# EAGLE design 2te4x230_In_apli (EAGLE 5.00)
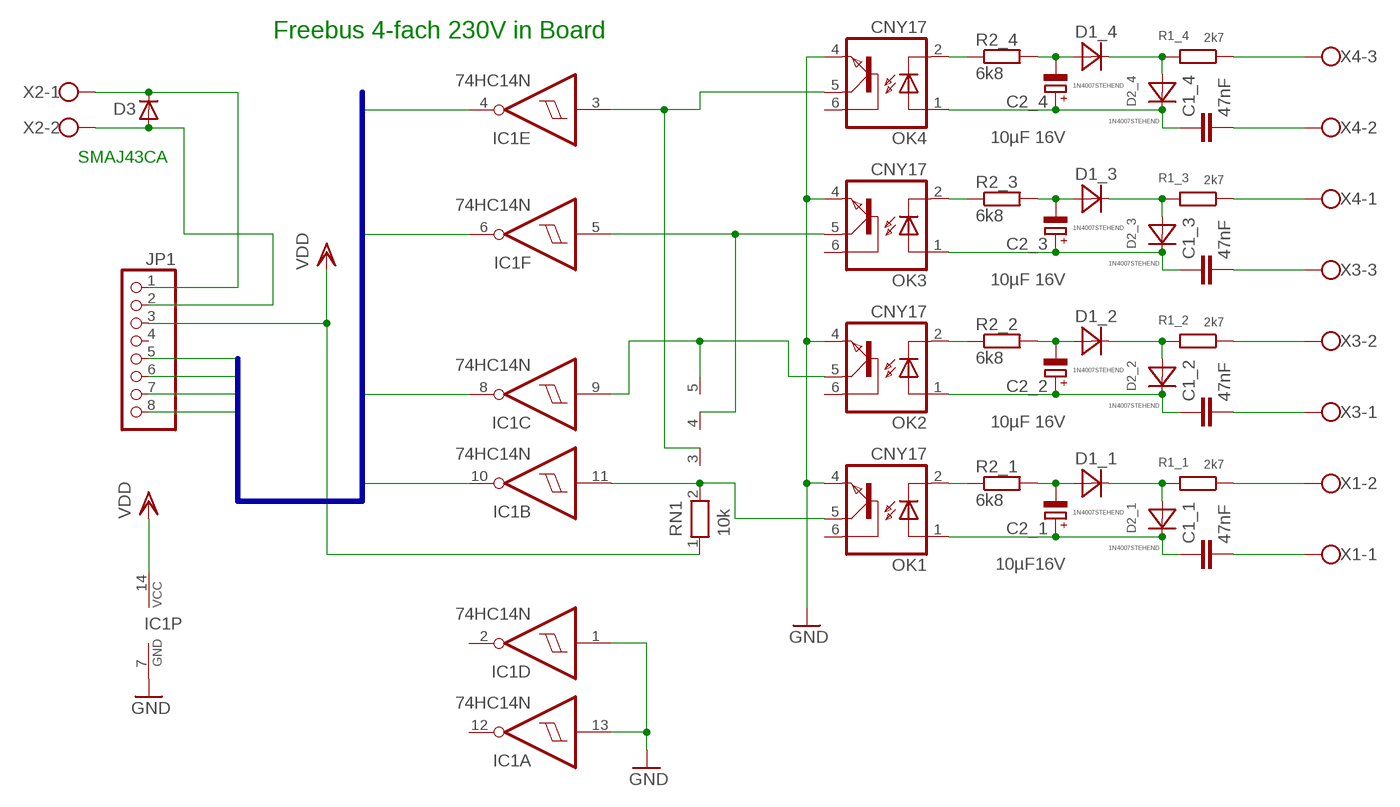
[diagram p0: schematic, sheet 1]

## Parts
C1_1  47nF  C-EU075-063X106  [C075-063X106]
C1_2  47nF  C-EU075-063X106  [C075-063X106]
C1_3  47nF  C-EU075-063X106  [C075-063X106]
C1_4  47nF  C-EU075-063X106  [C075-063X106]
C2_1  10µF16V  CPOL-EUE2-4  [E2-4]
C2_2  10µF 16V  CPOL-EUE2-4  [E2-4]
C2_3  10µF 16V  CPOL-EUE2-4  [E2-4]
C2_4  10µF 16V  CPOL-EUE2-4  [E2-4]
D1_1  1N4007STEHEND  [RAD2,5]
D1_2  1N4007STEHEND  [RAD2,5]
D1_3  1N4007STEHEND  [RAD2,5]
D1_4  1N4007STEHEND  [RAD2,5]
D2_1  1N4007STEHEND  [RAD2,5]
D2_2  1N4007STEHEND  [RAD2,5]
D2_3  1N4007STEHEND  [RAD2,5]
D2_4  1N4007STEHEND  [RAD2,5]
D3  D-  [SMA]
IC1  74HC14N  [DIL14]
JP1  PINHD-1X8  [1X08]
OK1  CNY17  [DIL06]
OK2  CNY17  [DIL06]
OK3  CNY17  [DIL06]
OK4  CNY17  [DIL06]
R1_1  2k7  R-EU_0207/2V  [0207/2V]
R1_2  2k7  R-EU_0207/2V  [0207/2V]
R1_3  2k7  R-EU_0207/2V  [0207/2V]
R1_4  2k7  R-EU_0207/2V  [0207/2V]
R2_1  6k8  R-EU_0207/2V  [0207/2V]
R2_2  6k8  R-EU_0207/2V  [0207/2V]
R2_3  6k8  R-EU_0207/2V  [0207/2V]
R2_4  6k8  R-EU_0207/2V  [0207/2V]
RN1  10k  RN04  [RN-5]
X1  W237-02P  [W237-132]
X2  W237-02P  [W237-132]
X3  W237-3E  [W237-3E]
X4  W237-3E  [W237-3E]

## Nets
230+_1: C1_1.1 C2_1.+ D2_1.C OK1.1(A)
230+_2: C1_2.1 C2_2.+ D2_2.C OK2.1(A)
230+_3: C1_3.1 C2_3.+ D2_3.C OK3.1(A)
230+_4: C1_4.1 C2_4.+ D2_4.C OK4.1(A)
230-_1: C2_1.- D1_1.A R2_1.2
230-_2: C2_2.- D1_2.A R2_2.2
230-_3: C2_3.- D1_3.A R2_3.2
230-_4: C2_4.- D1_4.A R2_4.2
230N_1: D1_1.C D2_1.A R1_1.2
230N_2: D1_2.C D2_2.A R1_2.2
230N_3: D1_3.C D2_3.A R1_3.2
230N_4: D1_4.C D2_4.A R1_4.2
GND: D3.2(A) IC1.1(D:I) IC1.7(P:GND) IC1.13(A:I) JP1.2 OK1.4(EMI) OK2.4(EMI) OK3.4(EMI) OK4.4(EMI) X2.2
IO1: IC1.10(B:O) JP1.8
IO2: IC1.8(C:O) JP1.7
IO3: IC1.6(F:O) JP1.6
IO4: IC1.4(E:O) JP1.5
N$1: C1_1.2 X1.1
N$2: R1_1.1 X1.2
N$4: D3.1(C) JP1.1 X2.1
N$5: C1_2.2 X3.1
N$6: R1_2.1 X3.2
N$7: C1_3.2 X3.3
N$8: R1_3.1 X4.1
N$9: C1_4.2 X4.2
N$10: R1_4.1 X4.3
N$17: IC1.11(B:I) OK1.5(COL) RN1.2
N$19: IC1.9(C:I) OK2.5(COL) RN1.5
N$31: IC1.5(F:I) OK3.5(COL) RN1.4
N$37: IC1.3(E:I) OK4.5(COL) RN1.3
OPT_1: OK1.2(C) R2_1.1
OPT_2: OK2.2(C) R2_2.1
OPT_3: OK3.2(C) R2_3.1
OPT_4: OK4.2(C) R2_4.1
VDD: IC1.14(P:VCC) JP1.3 RN1.1
Unconnected: IC1.2(D:O) IC1.12(A:O) JP1.4 OK1.6(BAS) OK2.6(BAS) OK3.6(BAS) OK4.6(BAS)

## Buses
IO[1..8]

## Notes on the sheet
- Freebus 4-fach 230V in Board
- SMAJ43CA

## Library data of the parts
C1_1-C1_4 = rcl:C-EU: CAPACITOR, European symbol
C2_1-C2_4 = rcl:CPOL-EU: POLARIZED CAPACITOR, European symbol
D1_1-D1_4 D2_1-D2_4 = diode:1N4007
D3 = semicon-smd-ipc:D-: DIODE unfilled
IC1 = 74xx-eu:74*14: Hex schmitt trigger INVERTER
JP1 = pinhead:PINHD-1X8: PIN HEADER
OK1-OK4 = optocoupler:CNY17: SIEMENS OPTO COUPLER
R1_1-R1_4 R2_1-R2_4 = rcl:R-EU_: RESISTOR, European symbol
RN1 = resistor-net:RN04: RESISTOR NETWORK
X1 X2 = con-wago-508:W237-02P: WAGO SREW CLAMP
X3 X4 = con-wago-508:W237-3E: WAGO SREW CLAMP

## Board
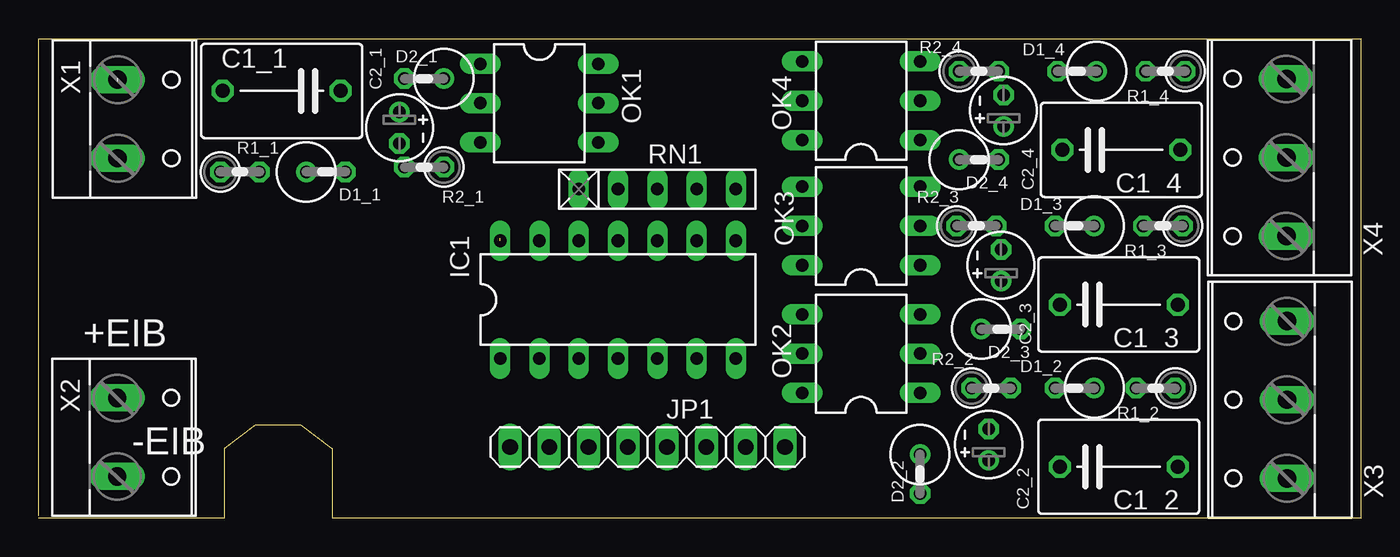
[diagram p1: board, top side]
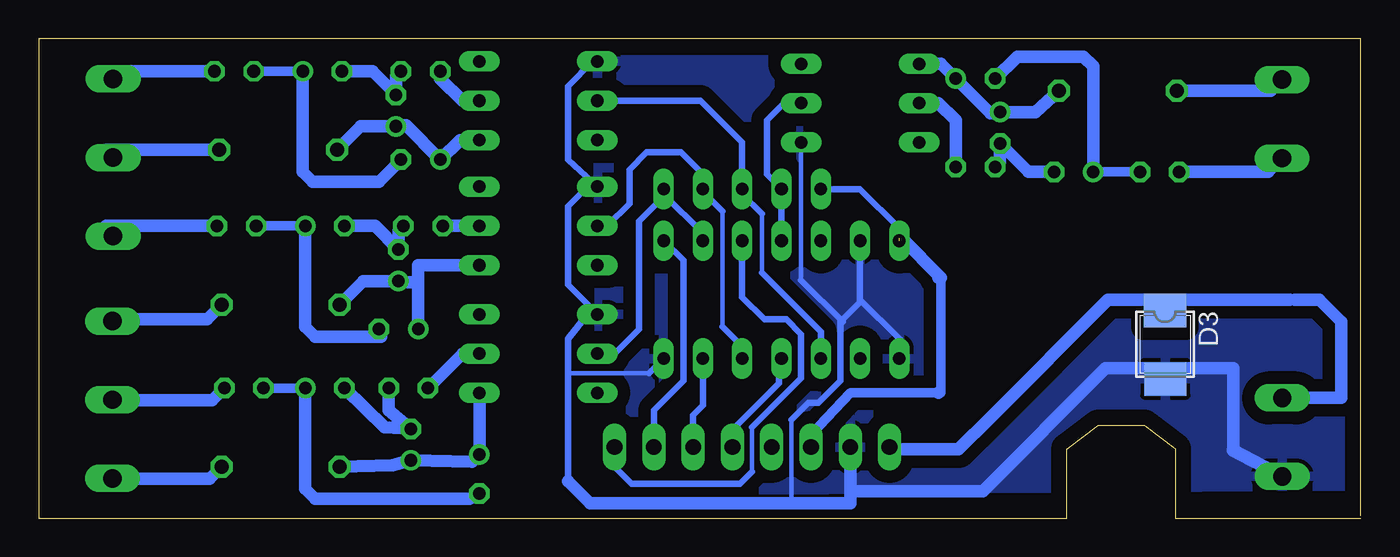
[diagram p2: board, bottom side, seen from below]

Size 85.5 x 31 mm. Coordinates in mm from the lower left corner, seen from the top.
Outline: 0.01,0.16 0.01,31 85.5,31 85.5,0 19,0 19,4.5 18.99,4.51 16.99,6.01 14.01,6.01 14.01,6 12,4.49 12,0 0,0
Copper layers (1*16): Top 0.035mm / dielectric 1.5mm / Bottom 0.035mm
Design rules "default": minimum track width 10mil, minimum drill 24mil, track to track 8mil, track to pad 8mil, pad to pad 8mil, via to via 8mil, smd to smd 8mil, copper to edge 40mil, drill to drill 8mil, minimum pad ring 10mil, minimum via ring 8mil, stop-mask expansion 4mil, vias tented up to drill 0mil, thermal gap 10mil

### Footprints (pad centres in the part's own frame; a part is rotated, then mirrored left to right if it is on the bottom)
C075-063X106 = drill 0.914 octagon: 1 -3.81,0; 2 3.81,0
E2-4 = drill 0.813 pad 1.27 round: + -1.016,0 | drill 0.813 pad 1.27 octagon: - 1.016,0
RAD2,5 = drill 0.813 octagon: A 1.27,0 | drill 0.813 round: C -1.27,0
SMB = smd 2.159 x 2.743: 1 -2.311,-0.127; 2 2.108,-0.102
DIL14 = drill 0.813 long: 1 -7.62,-3.81; 2 -5.08,-3.81; 3 -2.54,-3.81; 4 0,-3.81; 5 2.54,-3.81; 6 5.08,-3.81; 7 7.62,-3.81; 8 7.62,3.81; 9 5.08,3.81; 10 2.54,3.81; 11 0,3.81; 12 -2.54,3.81; 13 -5.08,3.81; 14 -7.62,3.81
1X08 = drill 1.016 long: 1 -8.89,0; 2 -6.35,0; 3 -3.81,0; 4 -1.27,0; 5 1.27,0; 6 3.81,0; 7 6.35,0; 8 8.89,0
DIL06 = drill 0.813 long: 1 -2.54,-3.81; 2 0,-3.81; 3 2.54,-3.81; 4 2.54,3.81; 5 0,3.81; 6 -2.54,3.81
0207/2V = drill 0.813 octagon: 1 -1.27,0; 2 1.27,0
RN-5 = drill 0.813 long: 1 -5.08,0; 2 -2.54,0; 3 0,0; 4 2.54,0; 5 5.08,0
W237-132 = drill 1.194 long: 1 -2.54,-0.635; 2 2.54,-0.635
W237-3E = drill 1.194 long: 1 -5.08,-0.635; 2 0,-0.635; 3 5.08,-0.635

### Placement (x,y rotation side)
C1_1  15.72,27.62 180 top
C1_2  69.85,3.34 0 top
C1_3  69.85,13.81 0 top
C1_4  70.01,23.81 0 top
C2_1  23.34,25.24 270 top
C2_2  61.44,4.76 90 top
C2_3  62.23,16.35 90 top
C2_4  62.39,26.35 90 top
D1_1  18.57,22.39 0 top
D1_2  66.99,8.42 180 top
D1_3  66.99,18.89 180 top
D1_4  67.15,28.89 180 top
D2_1  24.92,28.42 180 top
D2_2  56.99,2.86 270 top
D2_3  62.23,12.23 0 top
D2_4  60.8,23.18 0 top
D3  [SMB]  12.54,11.11 270 bottom
IC1  37.46,14.13 0 top
JP1  39.37,4.61 0 top
OK1  32.38,26.83 270 top
OK2  53.18,10.64 90 top
OK3  53.18,18.89 90 top
OK4  53.18,26.99 90 top
R1_1  13.02,22.39 0 top
R1_2  72.23,8.42 180 top
R1_3  72.71,18.89 180 top
R1_4  72.87,28.89 180 top
R2_1  24.92,22.7 180 top
R2_2  61.59,8.42 0 top
R2_3  60.64,18.89 0 top
R2_4  60.8,28.89 0 top
RN1  40,21.27 0 top
X1  5.74,25.81 270 top
X2  5.71,5.24 270 top
X3  80.1,7.66 90 top
X4  80.05,23.32 90 top

### Tracks (layer width: path | path; a pad name or v marks a point on that pad's centre or on a via)
230+_1
  Bottom 0.813: OK1.1 27.14,29.37 D2_1.C 23.97,26.2 23.33,26.2 C2_1.+ 21.05,26.26 C1_1.1
230+_2
  Bottom 0.813: OK2.1 56.99,6.99 D2_2.C 57.47,3.65 C2_2.+ 62.61,3.43 C1_2.1
230+_3
  Bottom 0.813: OK3.1 60.96,16.35 D2_3.C 60.96,15.24 61.59,15.24 C2_3.+ 64.52,15.34 C1_3.1
230+_4
  Bottom 0.813: OK4.1 58.26,24.45 D2_4.C 61.75,25.4 62.39,25.4 C2_4.+ 64.67,25.34 C1_4.1
230-_1
  Bottom 0.813: C2_1.- 23.33,24.29 | R2_1.2 23.33,23.02 C2_1.- | C2_1.- 21.49,22.39 D1_1.A
230-_2
  Bottom 0.813: C2_2.- 61.44,5.88 | R2_2.2 62.86,6.99 C2_2.- | C2_2.- 63.12,5.88 D1_2.A
230-_3
  Bottom 0.813: C2_3.- 62.23,17.31 | R2_3.2 62.23,18.58 C2_3.- | C2_3.- 63.75,18.89 D1_3.A
230-_4
  Bottom 0.813: C2_4.- 62.39,27.31 | R2_4.2 62.39,28.58 C2_4.- | C2_4.- 63.91,28.89 D1_4.A
230N_1
  Bottom 0.61: R1_1.2 D1_1.C
  Bottom 0.813: D1_1.C 17.3,29.21 17.94,29.85 22.22,29.85 D2_1.A
230N_2
  Bottom 0.61: D1_2.C R1_2.2
  Bottom 0.813: D1_2.C 68.26,1.91 67.63,1.27 57.62,1.27 D2_2.A
230N_3
  Bottom 0.61: D1_3.C R1_3.2
  Bottom 0.813: D1_3.C 68.26,12.38 67.63,11.75 63.34,11.75 D2_3.A
230N_4
  Bottom 0.61: D1_4.C R1_4.2
  Bottom 0.813: D1_4.C 68.42,22.39 67.78,21.75 63.5,21.75 D2_4.A
GND
  Bottom 0.305: 36.83,0.95 36.83,6.35 | 36.19,15.4 OK1.4 | 51.28,9.37 46.04,9.37
  Bottom 0.406: IC1.1 29.84,11.59 32.38,14.13 32.38,18.1 IC1.13 32.38,13.97 33.58,12.78 | 33.58,12.78 33.65,12.7 33.65,8.89 35.08,7.46 35.72,7.46 36.83,6.35 | 33.58,12.78 33.5,12.7 | 33.5,12.7 36.19,15.4 | 33.5,12.7 | 51.28,2.38 51.28,9.37 51.28,11.59 50.01,13.18 OK2.4 51.28,15.08 51.28,20.16 50.01,21.43 OK3.4 51.28,23.18 51.28,27.94 49.69,29.53 OK4.4 | 46.04,9.37 IC1.7 | D3.2 12.54,9.01 12.54,9.69 | OK1.4
  Bottom 0.813: X2.2 8.28,4.41 8.25,4.43 8.25,9.69 12.54,9.69 16.51,9.69 24.45,1.75 32.86,1.75 33.02,1.91 | JP1.2 33.02,3.02 33.02,1.91 | 33.02,1.91 33.02,0.95 36.83,0.95 49.85,0.95 51.28,2.38 | JP1.2
  pour Bottom (isolate 0.813): 0.63,14.61 3.17,17.15 35.4,17.15 36.35,17.46 36.35,30.01 49.37,30.01 49.21,2.07 48.89,1.75 0.63,2.07
IO1
  Bottom 0.305: 39.37,3.02 39.37,5.88
  Bottom 0.406: IC1.10 | IC1.10 40,14.29 38.58,12.86 37.15,12.86 36.19,11.91 36.19,9.05 39.37,5.88 | 39.37,3.02 40.16,2.22 47.15,2.22 48.26,3.34 JP1.8 | JP1.8
IO2
  Bottom 0.406: IC1.8 43.81,16.67 43.81,8.89 45.72,6.99 JP1.7 | JP1.7 45.72,4.45 | JP1.7
IO3
  Bottom 0.406: IC1.6 | IC1.6 42.54,7.3 43.18,6.67 JP1.6 | JP1.6
IO4
  Bottom 0.406: IC1.4 37.62,10.16 37.62,8.73 40.64,5.72 JP1.5 | JP1.5
N$1
  Bottom 0.813: X1.1 5.83,27.62 C1_1.2
N$2
  Bottom 0.813: X1.2 5.99,22.39 R1_1.1
N$4
  Bottom 0.406: D3.1 12.7,13.43 12.7,14.13 | 4.6,14.13 4.28,14.13 | JP1.1
  Bottom 0.813: 1.27,7.78 1.27,12.7 2.7,14.13 4.28,14.13 | 4.28,14.13 | X2.1 | 1.27,7.78 | 1.27,7.78 X2.1 | JP1.1 30.48,4.45 26.03,4.45 23.97,6.51 16.35,14.13 12.7,14.13 4.6,14.13 | JP1.1
N$5
  Bottom 0.406: 81.25,2.54 arc-90 X3.1
  Bottom 0.813: 81.25,2.54 81.28,2.54 | 81.25,2.54 X3.1 | C1_2.2 74.45,2.54 81.25,2.54
N$6
  Bottom 0.406: 81.17,7.62 arc90 X3.2
  Bottom 0.813: X3.2 81.17,7.62 74.29,7.62 R1_2.1
N$7
  Bottom 0.406: 81.28,12.86 81.28,12.81 arc-90 X3.3
  Bottom 0.813: 81.28,12.86 74.61,12.86 C1_3.2
N$8
  Bottom 0.813: X4.1 81.12,18.24 81.12,18.89 R1_3.1
N$9
  Bottom 0.406: 81.12,23.18 81.12,23.32 X4.2
  Bottom 0.813: C1_4.2 81.12,23.81 81.12,23.32
N$10
  Bottom 0.406: 81.12,28.4 X4.3
  Bottom 0.813: R1_4.1 81.12,28.89 81.12,28.4
N$17
  Bottom 0.406: RN1.2 | IC1.11 | IC1.11 RN1.2 | RN1.2 38.42,22.23 38.42,25.72 37.3,26.83 OK1.5 | OK1.5
N$19
  Bottom 0.406: IC1.9 42.54,18.42 45.08,20.96 | RN1.5 | RN1.5 | IC1.9 | OK2.5 48.26,10.64 46.67,12.23 46.67,19.21 45.08,20.8 45.08,20.96 | RN1.5 | RN1.5 | 45.08,20.96 RN1.5
N$31
  Bottom 0.305: 41.27,12.38 41.27,19.85
  Bottom 0.406: IC1.5 40,11.11 41.27,12.38 | 42.54,21.12 | 42.54,21.12 RN1.4 42.54,22.23 43.97,23.66 46.2,23.66 47.31,22.54 47.31,20.32 48.73,18.89 OK3.5 | 41.27,19.85 42.54,21.12
N$37
  Bottom 0.305: 38.73,15.88 38.73,19.69
  Bottom 0.406: RN1.3 40,20.96 38.73,19.69 | RN1.3 | RN1.3 40,24.29 42.7,26.99 OK4.5 | 38.73,15.88 34.92,12.07 IC1.3 | IC1.3
OPT_1
  Bottom 0.813: OK1.2 arc90 28.41,26.99 arc-90 28.26,26.83 27.3,26.83 26.19,25.72 R2_1.1
OPT_2
  Bottom 0.813: OK2.2 58.1,10.64 R2_2.1 | R2_2.1
OPT_3
  Bottom 0.813: OK3.2 58.1,18.89 58.58,18.89 R2_3.1
OPT_4
  Bottom 0.813: OK4.2 58.1,26.99 59.53,28.42 R2_4.1
VDD  (1 unrouted)
  Bottom 0.406: RN1.1 32.38,21.27 29.84,18.73 29.84,18.1
  Bottom 0.61: 27.14,8.1 27.3,8.1 | 27.14,8.1 33.02,8.1 35.56,5.4 JP1.3 | 27.14,8.1 27.14,15.56
  Bottom 0.813: 27.3,15.56 27.14,15.56 29.68,18.1 30,18.1 | 30,18.1 | 30,18.1 IC1.14 | 27.3,8.1 | JP1.3

### Text on the board
tPlace: +EIB | -EIB